# Altium project LED Matrix.PrjPcb
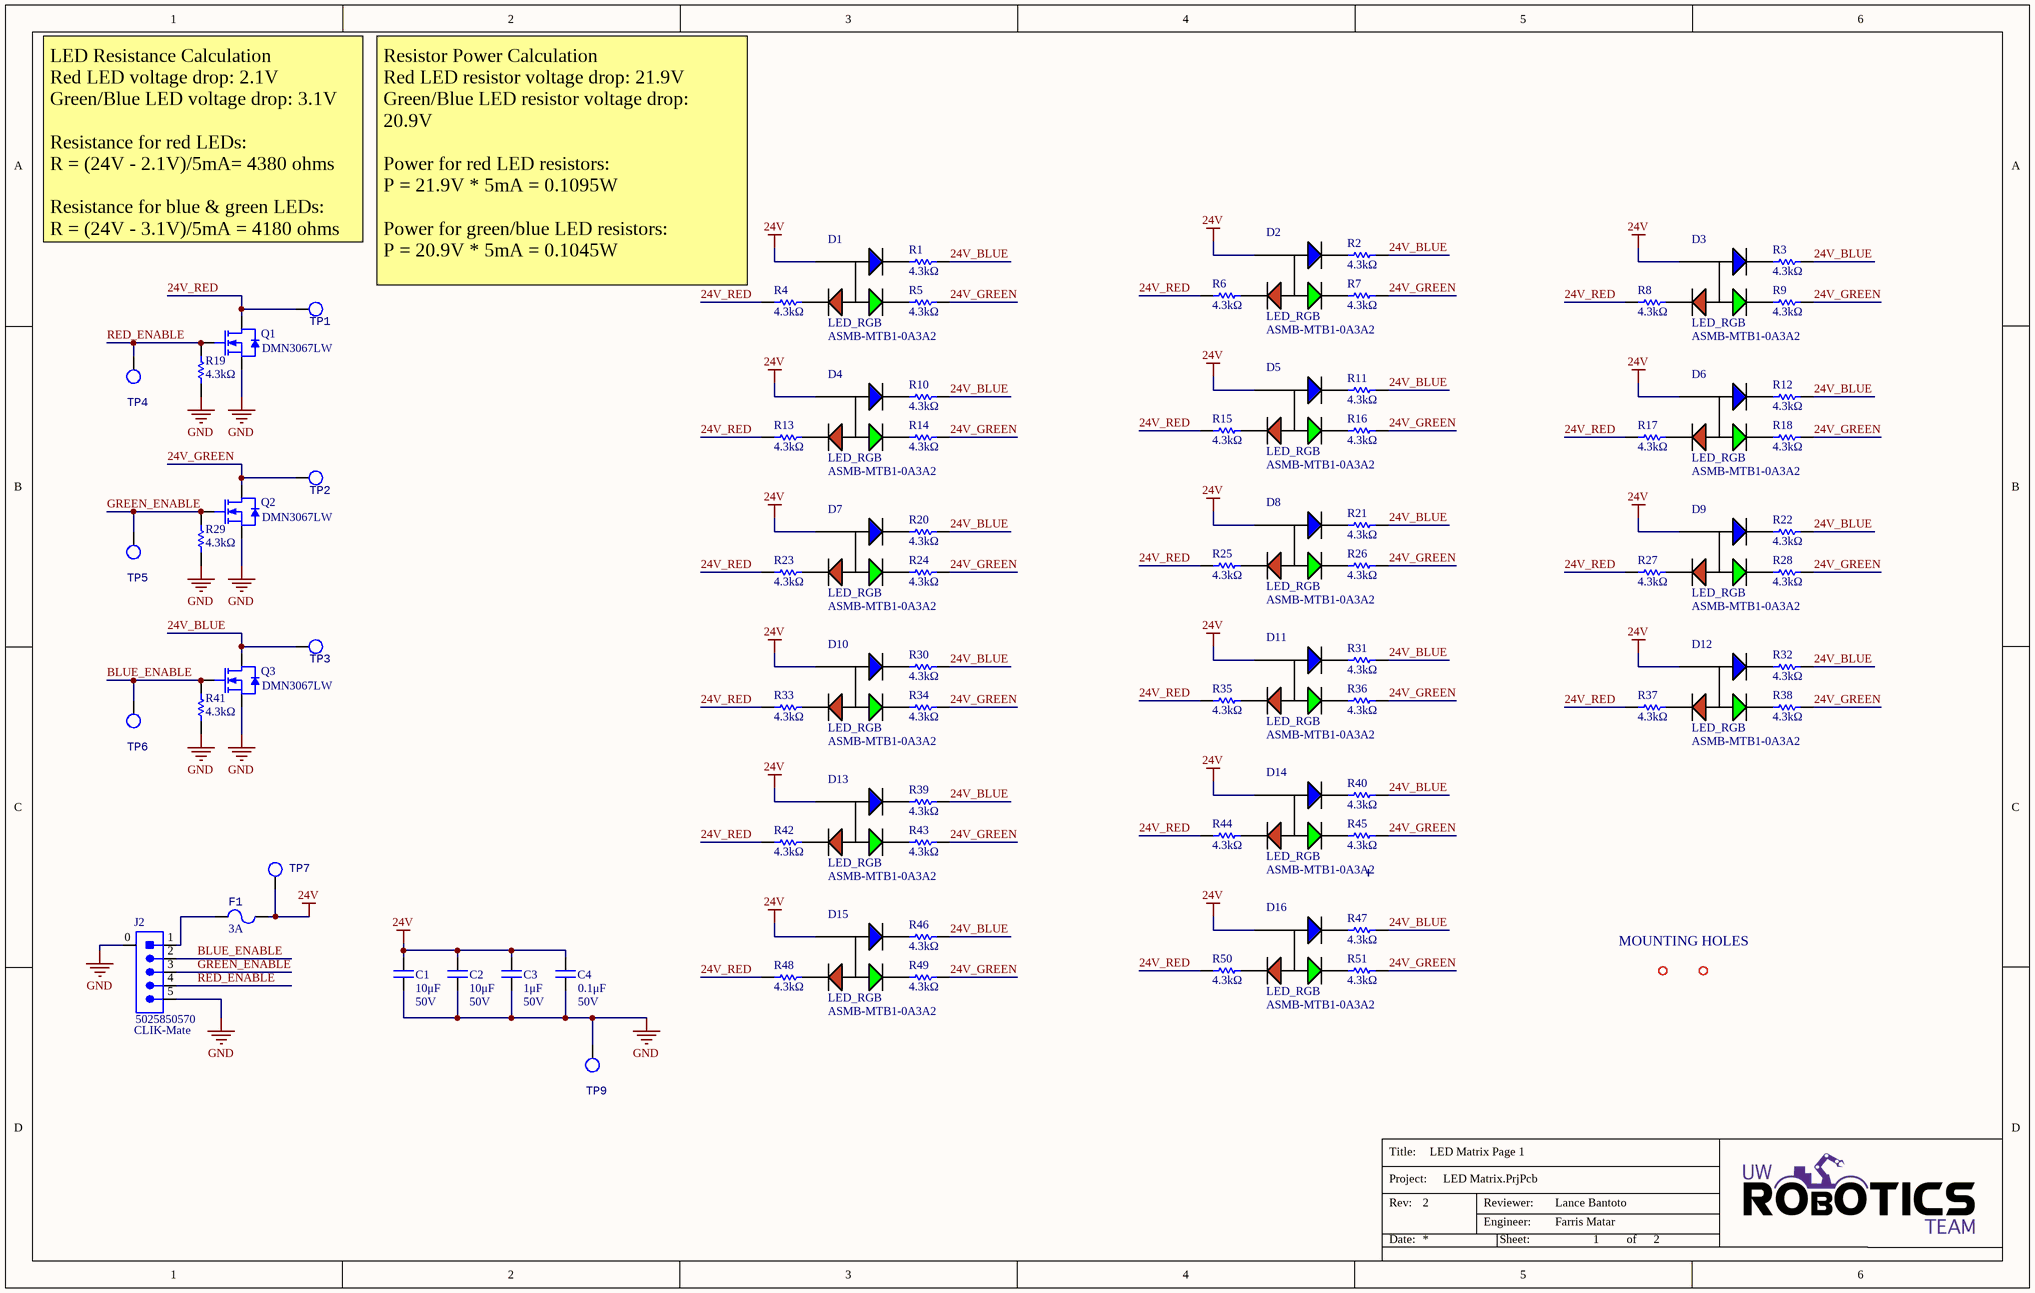
[diagram p0: LED Matrix.SchDoc]
2 sheets, 150 parts. Net scope: global (net labels, ports and power ports of the same name join across sheets).
Board file: LED Matrix.PcbDoc
Sheets:
  LED Matrix.SchDoc
  LED Matrix-2.SchDoc

## Sheet LED Matrix.SchDoc: LED Matrix Page 1
size B; CheckedBy: Lance Bantoto; Engineer: Farris Matar; Revision: 2; SheetNumber: 1; SheetTotal: 2

### Parts
C1  value 10μF  Voltage Rating: 50V  [CAP1210]  (hidden comment: CAP_10uF_50V_1210)
C2  value 10μF  Voltage Rating: 50V  [CAP1210]  (hidden comment: CAP_10uF_50V_1210)
C3  value 1μF  Voltage Rating: 50V  [CAP2012]  (hidden comment: CAP_1uF_50V_0805)
C4  value 0.1μF  Voltage Rating: 50V  [CAP2012]  (hidden comment: CAP_0.1uF_50V_0805)
D1  LED_RGB  Manufacturer Part Number 1: ASMB-MTB1-0A3A2  [LED_RGB]
D2  LED_RGB  Manufacturer Part Number 1: ASMB-MTB1-0A3A2  [LED_RGB]
D3  LED_RGB  Manufacturer Part Number 1: ASMB-MTB1-0A3A2  [LED_RGB]
D4  LED_RGB  Manufacturer Part Number 1: ASMB-MTB1-0A3A2  [LED_RGB]
D5  LED_RGB  Manufacturer Part Number 1: ASMB-MTB1-0A3A2  [LED_RGB]
D6  LED_RGB  Manufacturer Part Number 1: ASMB-MTB1-0A3A2  [LED_RGB]
D7  LED_RGB  Manufacturer Part Number 1: ASMB-MTB1-0A3A2  [LED_RGB]
D8  LED_RGB  Manufacturer Part Number 1: ASMB-MTB1-0A3A2  [LED_RGB]
D9  LED_RGB  Manufacturer Part Number 1: ASMB-MTB1-0A3A2  [LED_RGB]
D10  LED_RGB  Manufacturer Part Number 1: ASMB-MTB1-0A3A2  [LED_RGB]
D11  LED_RGB  Manufacturer Part Number 1: ASMB-MTB1-0A3A2  [LED_RGB]
D12  LED_RGB  Manufacturer Part Number 1: ASMB-MTB1-0A3A2  [LED_RGB]
D13  LED_RGB  Manufacturer Part Number 1: ASMB-MTB1-0A3A2  [LED_RGB]
D14  LED_RGB  Manufacturer Part Number 1: ASMB-MTB1-0A3A2  [LED_RGB]
D15  LED_RGB  Manufacturer Part Number 1: ASMB-MTB1-0A3A2  [LED_RGB]
D16  LED_RGB  Manufacturer Part Number 1: ASMB-MTB1-0A3A2  [LED_RGB]
F1  Current Rating: 3A  [FUSE_1206]  (hidden comment: FUSE_3A_1206)
J2  Manufacturer Part Number 1: 5025850570  Family: CLIK-Mate  [MOLEX-5025850570]  (hidden comment: CON_5M_SM_RA)
MH1  MOUNTING_HOLES  [MOUNTING_HOLE]  (value not drawn)
MH2  MOUNTING_HOLES  [MOUNTING_HOLE]  (value not drawn)
Q1  Manufacturer Part Number 1: DMN3067LW  [NMOS_SOT-323]  (hidden comment: NMOS_30V_2.6A)
Q2  Manufacturer Part Number 1: DMN3067LW  [NMOS_SOT-323]  (hidden comment: NMOS_30V_2.6A)
Q3  Manufacturer Part Number 1: DMN3067LW  [NMOS_SOT-323]  (hidden comment: NMOS_30V_2.6A)
R1  Resistance: 4.3kΩ  [RES1210]  (hidden comment: RES_4.3kΩ_1210_5%)
R2  Resistance: 4.3kΩ  [RES1210]  (hidden comment: RES_4.3kΩ_1210_5%)
R3  Resistance: 4.3kΩ  [RES1210]  (hidden comment: RES_4.3kΩ_1210_5%)
R4  Resistance: 4.3kΩ  [RES1210]  (hidden comment: RES_4.3kΩ_1210_5%)
R5  Resistance: 4.3kΩ  [RES1210]  (hidden comment: RES_4.3kΩ_1210_5%)
R6  Resistance: 4.3kΩ  [RES1210]  (hidden comment: RES_4.3kΩ_1210_5%)
R7  Resistance: 4.3kΩ  [RES1210]  (hidden comment: RES_4.3kΩ_1210_5%)
R8  Resistance: 4.3kΩ  [RES1210]  (hidden comment: RES_4.3kΩ_1210_5%)
R9  Resistance: 4.3kΩ  [RES1210]  (hidden comment: RES_4.3kΩ_1210_5%)
R10  Resistance: 4.3kΩ  [RES1210]  (hidden comment: RES_4.3kΩ_1210_5%)
R11  Resistance: 4.3kΩ  [RES1210]  (hidden comment: RES_4.3kΩ_1210_5%)
R12  Resistance: 4.3kΩ  [RES1210]  (hidden comment: RES_4.3kΩ_1210_5%)
R13  Resistance: 4.3kΩ  [RES1210]  (hidden comment: RES_4.3kΩ_1210_5%)
R14  Resistance: 4.3kΩ  [RES1210]  (hidden comment: RES_4.3kΩ_1210_5%)
R15  Resistance: 4.3kΩ  [RES1210]  (hidden comment: RES_4.3kΩ_1210_5%)
R16  Resistance: 4.3kΩ  [RES1210]  (hidden comment: RES_4.3kΩ_1210_5%)
R17  Resistance: 4.3kΩ  [RES1210]  (hidden comment: RES_4.3kΩ_1210_5%)
R18  Resistance: 4.3kΩ  [RES1210]  (hidden comment: RES_4.3kΩ_1210_5%)
R19  Resistance: 4.3kΩ  [RES1210]  (hidden comment: RES_4.3kΩ_1210_5%)
R20  Resistance: 4.3kΩ  [RES1210]  (hidden comment: RES_4.3kΩ_1210_5%)
R21  Resistance: 4.3kΩ  [RES1210]  (hidden comment: RES_4.3kΩ_1210_5%)
R22  Resistance: 4.3kΩ  [RES1210]  (hidden comment: RES_4.3kΩ_1210_5%)
R23  Resistance: 4.3kΩ  [RES1210]  (hidden comment: RES_4.3kΩ_1210_5%)
R24  Resistance: 4.3kΩ  [RES1210]  (hidden comment: RES_4.3kΩ_1210_5%)
R25  Resistance: 4.3kΩ  [RES1210]  (hidden comment: RES_4.3kΩ_1210_5%)
R26  Resistance: 4.3kΩ  [RES1210]  (hidden comment: RES_4.3kΩ_1210_5%)
R27  Resistance: 4.3kΩ  [RES1210]  (hidden comment: RES_4.3kΩ_1210_5%)
R28  Resistance: 4.3kΩ  [RES1210]  (hidden comment: RES_4.3kΩ_1210_5%)
R29  Resistance: 4.3kΩ  [RES1210]  (hidden comment: RES_4.3kΩ_1210_5%)
R30  Resistance: 4.3kΩ  [RES1210]  (hidden comment: RES_4.3kΩ_1210_5%)
R31  Resistance: 4.3kΩ  [RES1210]  (hidden comment: RES_4.3kΩ_1210_5%)
R32  Resistance: 4.3kΩ  [RES1210]  (hidden comment: RES_4.3kΩ_1210_5%)
R33  Resistance: 4.3kΩ  [RES1210]  (hidden comment: RES_4.3kΩ_1210_5%)
R34  Resistance: 4.3kΩ  [RES1210]  (hidden comment: RES_4.3kΩ_1210_5%)
R35  Resistance: 4.3kΩ  [RES1210]  (hidden comment: RES_4.3kΩ_1210_5%)
R36  Resistance: 4.3kΩ  [RES1210]  (hidden comment: RES_4.3kΩ_1210_5%)
R37  Resistance: 4.3kΩ  [RES1210]  (hidden comment: RES_4.3kΩ_1210_5%)
R38  Resistance: 4.3kΩ  [RES1210]  (hidden comment: RES_4.3kΩ_1210_5%)
R39  Resistance: 4.3kΩ  [RES1210]  (hidden comment: RES_4.3kΩ_1210_5%)
R40  Resistance: 4.3kΩ  [RES1210]  (hidden comment: RES_4.3kΩ_1210_5%)
R41  Resistance: 4.3kΩ  [RES1210]  (hidden comment: RES_4.3kΩ_1210_5%)
R42  Resistance: 4.3kΩ  [RES1210]  (hidden comment: RES_4.3kΩ_1210_5%)
R43  Resistance: 4.3kΩ  [RES1210]  (hidden comment: RES_4.3kΩ_1210_5%)
R44  Resistance: 4.3kΩ  [RES1210]  (hidden comment: RES_4.3kΩ_1210_5%)
R45  Resistance: 4.3kΩ  [RES1210]  (hidden comment: RES_4.3kΩ_1210_5%)
R46  Resistance: 4.3kΩ  [RES1210]  (hidden comment: RES_4.3kΩ_1210_5%)
R47  Resistance: 4.3kΩ  [RES1210]  (hidden comment: RES_4.3kΩ_1210_5%)
R48  Resistance: 4.3kΩ  [RES1210]  (hidden comment: RES_4.3kΩ_1210_5%)
R49  Resistance: 4.3kΩ  [RES1210]  (hidden comment: RES_4.3kΩ_1210_5%)
R50  Resistance: 4.3kΩ  [RES1210]  (hidden comment: RES_4.3kΩ_1210_5%)
R51  Resistance: 4.3kΩ  [RES1210]  (hidden comment: RES_4.3kΩ_1210_5%)
TP1  TESTPOINT_LOOP  [TESTPOINT_LOOP]  (value not drawn)
TP2  TESTPOINT_LOOP  [TESTPOINT_LOOP]  (value not drawn)
TP3  TESTPOINT_LOOP  [TESTPOINT_LOOP]  (value not drawn)
TP4  TESTPOINT_LOOP  [TESTPOINT_LOOP]  (value not drawn)
TP5  TESTPOINT_LOOP  [TESTPOINT_LOOP]  (value not drawn)
TP6  TESTPOINT_LOOP  [TESTPOINT_LOOP]  (value not drawn)
TP7  TESTPOINT_LOOP  [TESTPOINT_LOOP]  (value not drawn)
TP9  TESTPOINT_LOOP  [TESTPOINT_LOOP]  (value not drawn)

### Nets
24V: C1.2 C2.2 C3.1 C4.2 D1.4(COMMON_ANODE) D2.4(COMMON_ANODE) D3.4(COMMON_ANODE) D4.4(COMMON_ANODE) D5.4(COMMON_ANODE) D6.4(COMMON_ANODE) D7.4(COMMON_ANODE) D8.4(COMMON_ANODE) D9.4(COMMON_ANODE) D10.4(COMMON_ANODE) D11.4(COMMON_ANODE) D12.4(COMMON_ANODE) D13.4(COMMON_ANODE) D14.4(COMMON_ANODE) D15.4(COMMON_ANODE) D16.4(COMMON_ANODE) F1.1 TP7.1
GND: C1.1 C2.1 C3.2 C4.1 J2.0 J2.5 Q1.2(SOURCE) Q2.2(SOURCE) Q3.2(SOURCE) R19.1 R29.1 R41.1 TP9.1
24V_BLUE: Q3.3(DRAIN) R1.2 R2.2 R3.2 R10.2 R11.2 R12.2 R20.1 R21.1 R22.1 R30.2 R31.2 R32.2 R39.1 R40.2 R46.2 R47.2 TP3.1
24V_GREEN: Q2.3(DRAIN) R5.2 R7.2 R9.2 R14.2 R16.2 R18.2 R24.2 R26.2 R28.2 R34.2 R36.2 R38.2 R43.2 R45.2 R49.2 R51.2 TP2.1
24V_RED: Q1.3(DRAIN) R4.1 R6.1 R8.1 R13.1 R15.1 R17.1 R23.2 R25.1 R27.1 R33.1 R35.1 R37.1 R42.1 R44.1 R48.1 R50.1 TP1.1
BLUE_ENABLE: J2.2 Q3.1(GATE) R41.2 TP6.1
GREEN_ENABLE: J2.3 Q2.1(GATE) R29.2 TP5.1
RED_ENABLE: J2.4 Q1.1(GATE) R19.2 TP4.1
NetD1_1: D1.1(CATHODE_(RED)) R4.2
NetD1_2: D1.2(CATHODE_(GREEN)) R5.1
NetD1_3: D1.3(CATHODE_(BLUE)) R1.1
NetD2_1: D2.1(CATHODE_(RED)) R6.2
NetD2_2: D2.2(CATHODE_(GREEN)) R7.1
NetD2_3: D2.3(CATHODE_(BLUE)) R2.1
NetD3_1: D3.1(CATHODE_(RED)) R8.2
NetD3_2: D3.2(CATHODE_(GREEN)) R9.1
NetD3_3: D3.3(CATHODE_(BLUE)) R3.1
NetD4_1: D4.1(CATHODE_(RED)) R13.2
NetD4_2: D4.2(CATHODE_(GREEN)) R14.1
NetD4_3: D4.3(CATHODE_(BLUE)) R10.1
NetD5_1: D5.1(CATHODE_(RED)) R15.2
NetD5_2: D5.2(CATHODE_(GREEN)) R16.1
NetD5_3: D5.3(CATHODE_(BLUE)) R11.1
NetD6_1: D6.1(CATHODE_(RED)) R17.2
NetD6_2: D6.2(CATHODE_(GREEN)) R18.1
NetD6_3: D6.3(CATHODE_(BLUE)) R12.1
NetD7_1: D7.1(CATHODE_(RED)) R23.1
NetD7_2: D7.2(CATHODE_(GREEN)) R24.1
NetD7_3: D7.3(CATHODE_(BLUE)) R20.2
NetD8_1: D8.1(CATHODE_(RED)) R25.2
NetD8_2: D8.2(CATHODE_(GREEN)) R26.1
NetD8_3: D8.3(CATHODE_(BLUE)) R21.2
NetD9_1: D9.1(CATHODE_(RED)) R27.2
NetD9_2: D9.2(CATHODE_(GREEN)) R28.1
NetD9_3: D9.3(CATHODE_(BLUE)) R22.2
NetD10_1: D10.1(CATHODE_(RED)) R33.2
NetD10_2: D10.2(CATHODE_(GREEN)) R34.1
NetD10_3: D10.3(CATHODE_(BLUE)) R30.1
NetD11_1: D11.1(CATHODE_(RED)) R35.2
NetD11_2: D11.2(CATHODE_(GREEN)) R36.1
NetD11_3: D11.3(CATHODE_(BLUE)) R31.1
NetD12_1: D12.1(CATHODE_(RED)) R37.2
NetD12_2: D12.2(CATHODE_(GREEN)) R38.1
NetD12_3: D12.3(CATHODE_(BLUE)) R32.1
NetD13_1: D13.1(CATHODE_(RED)) R42.2
NetD13_2: D13.2(CATHODE_(GREEN)) R43.1
NetD13_3: D13.3(CATHODE_(BLUE)) R39.2
NetD14_1: D14.1(CATHODE_(RED)) R44.2
NetD14_2: D14.2(CATHODE_(GREEN)) R45.1
NetD14_3: D14.3(CATHODE_(BLUE)) R40.1
NetD15_1: D15.1(CATHODE_(RED)) R48.2
NetD15_2: D15.2(CATHODE_(GREEN)) R49.1
NetD15_3: D15.3(CATHODE_(BLUE)) R46.1
NetD16_1: D16.1(CATHODE_(RED)) R50.2
NetD16_2: D16.2(CATHODE_(GREEN)) R51.1
NetD16_3: D16.3(CATHODE_(BLUE)) R47.1
NetF1_2: F1.2 J2.1

### Notes on the sheet
- LED Resistance Calculation
  Red LED voltage drop: 2.1V
  Green/Blue LED voltage drop: 3.1V
  Resistance for red LEDs:
  R = (24V - 2.1V)/5mA= 4380 ohms
  Resistance for blue & green LEDs:
  R = (24V - 3.1V)/5mA = 4180 ohms
- (near R4) Resistor Power Calculation
  Red LED resistor voltage drop: 21.9V
  Green/Blue LED resistor voltage drop: 20.9V
  Power for red LED resistors:
  P = 21.9V * 5mA = 0.1095W
  Power for green/blue LED resistors:
  P = 20.9V * 5mA = 0.1045W
  All resistors used in this schematic are 1210
- MOUNTING HOLES
- Title:
- Project:
- Date:
- Rev:
- Reviewer:
- Engineer:
- Sheet:
- of

### Library data of the parts
C1 C2 = CAP_10uF_50V_1210: CAP CER 10UF 50V X7R 1210; Manufacturer 1: Murata Electronics; Manufacturer Part Number 1: GRM32ER71H106MA12L; Supplier 1: Digi-Key; Supplier Part Number 1: 490-12775-1-ND; Dielectric: X7R
C3 = CAP_1uF_50V_0805: CAP CER 1UF 50V X7R 0805; Manufacturer Part Number 1: CL21B105KBFNNNG; Manufacturer 1: Samsung Electro-Mechanics; Package/Footprint: 0805; Supplier 1: Digi-Key; Supplier Part Number 1: 1276-6470-1-ND; Mounting Type: SMD; LCSC Part #: C28323
C4 = CAP_0.1uF_50V_0805: CAP CER 0.1UF 50V X7R 0805; Manufacturer 1: Murata Electronics; Manufacturer Part Number 1: GCM21BR71H104KA37K; Package/Footprint: 0805; Supplier 1: Digi-Key; Dielectric: X7R; Supplier Part Number 1: 490-8049-1-ND; Mounting Type: SMD; LCSC Part #: C49678
D1-D16 = LED_RGB: LED RGB DIFFUSED 4PLCC SMD; Manufacturer 1: Broadcom; Color: Blue,Green,Red; Lens Color: White; Viewing Angle: 115°; Lens Style: Round; Luminous Intensity: 350mcd; Dominant Wavelength: 470nm; Forward Voltage: 3.1V; Test Current: 20mA; Package/Footprint: 4-PLCC; Supplier 1: Digi-Key; Number of Pins: 4; Lens Transparency: Diffused; Supplier Part Number 1: 516-3280-1-ND; Mounting Type: SMD
F1 = FUSE_3A_1206: FUSE BOARD MNT 3A 32VAC/VDC 1206; Manufacturer 1: Littelfuse; Manufacturer Part Number 1: 0466003.NR; Package/Footprint: 1206; Supplier 1: Digi-Key; Supplier Part Number 1: F1458CT-ND; Mounting Type: SMD
J2 = CON_5M_SM_RA: CONN HEADER SMD RIGHT ANGLE 1.5MM PITCH; Manufacturer 1: Molex; Current Rating: 2A; Supplier Part Number 1: WM14469CT-ND; Supplier 1: Digi-Key; Mounting Type: SMD; Package/Footprint: SMD; Orientation: Right Angle
MH1 MH2 = MOUNTING_HOLES: 6cm x 6cm
Q1-Q3 = NMOS_30V_2.6A: MOSFET N-CH 30V 2.6A SOT-323; Manufacturer 1: Diodes Incorporated; Vgs (Max): ±12V; Supplier 1: Digi-Key; Supplier Part Number 1: DMN3067LW-7DICT-ND; Mounting Type: SMD; Package/Footprint: SOT-323; Vdss: 30V; Id: 2.6A
R1-R51 = RES_4.3kΩ_1210_5%: RES 4.3K OHM 5% 1/2W 1210; Manufacturer 1: Panasonic; Manufacturer Part Number 1: ERJ-14YJ432U; Supplier 1: Digi-Key; Tolerance: 5%; Supplier Part Number 1: P4.3KVCT-ND; Package: 1210; Mounting Type: SMD
TP1-TP7 TP9 = TESTPOINT_LOOP: TESTPOINT THRUHOLE; Manufacturer 1: Keystone Electronics; Manufacturer Part Number 1: 5002; Package/Footprint: TH; Supplier Part Number 1: 36-5002-ND; Supplier 1: Digi-Key; Mounting Type: TH

## Sheet LED Matrix-2.SchDoc: LED Matrix Page 2
size B; CheckedBy: Lance Bantoto; Engineer: Farris Matar; Revision: 2; SheetNumber: 2; SheetTotal: 2
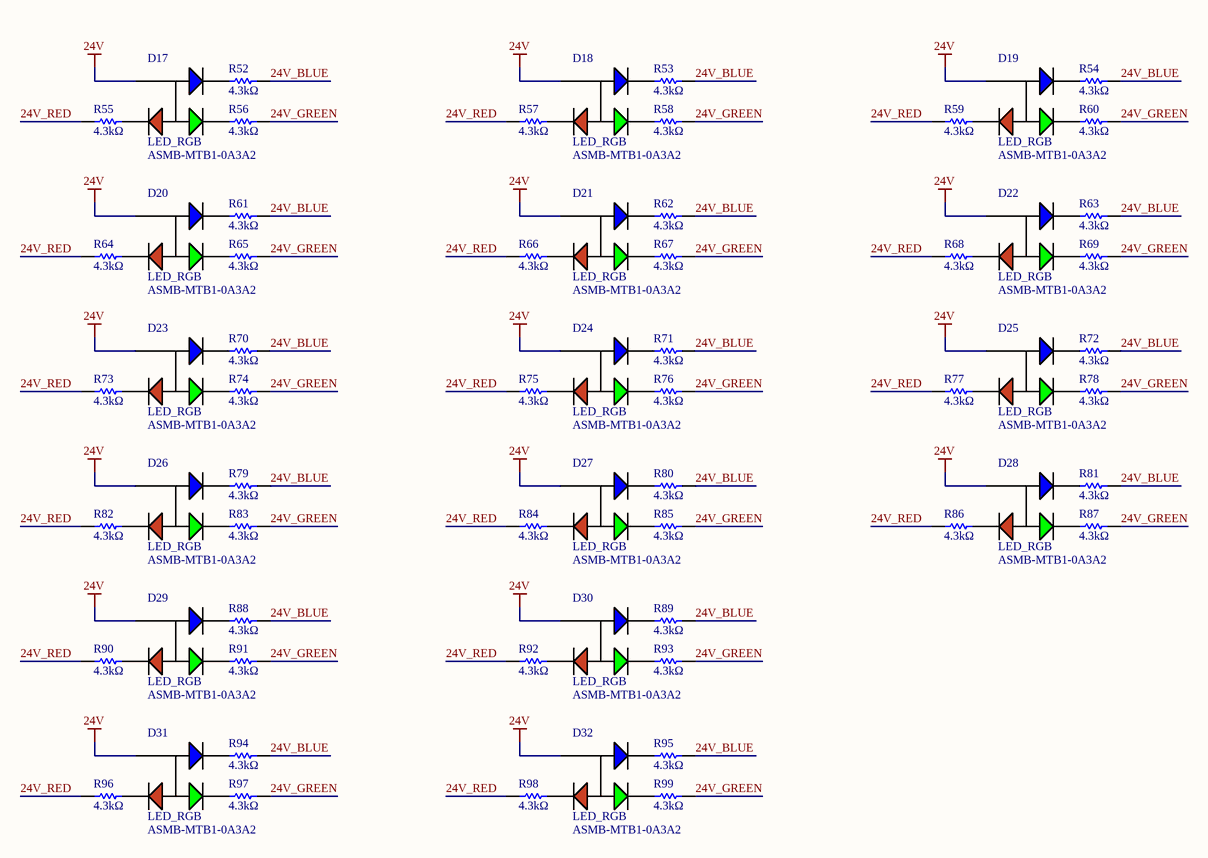
[diagram p1: LED Matrix-2.SchDoc]

### Parts
D17  LED_RGB  Manufacturer Part Number 1: ASMB-MTB1-0A3A2  [LED_RGB]
D18  LED_RGB  Manufacturer Part Number 1: ASMB-MTB1-0A3A2  [LED_RGB]
D19  LED_RGB  Manufacturer Part Number 1: ASMB-MTB1-0A3A2  [LED_RGB]
D20  LED_RGB  Manufacturer Part Number 1: ASMB-MTB1-0A3A2  [LED_RGB]
D21  LED_RGB  Manufacturer Part Number 1: ASMB-MTB1-0A3A2  [LED_RGB]
D22  LED_RGB  Manufacturer Part Number 1: ASMB-MTB1-0A3A2  [LED_RGB]
D23  LED_RGB  Manufacturer Part Number 1: ASMB-MTB1-0A3A2  [LED_RGB]
D24  LED_RGB  Manufacturer Part Number 1: ASMB-MTB1-0A3A2  [LED_RGB]
D25  LED_RGB  Manufacturer Part Number 1: ASMB-MTB1-0A3A2  [LED_RGB]
D26  LED_RGB  Manufacturer Part Number 1: ASMB-MTB1-0A3A2  [LED_RGB]
D27  LED_RGB  Manufacturer Part Number 1: ASMB-MTB1-0A3A2  [LED_RGB]
D28  LED_RGB  Manufacturer Part Number 1: ASMB-MTB1-0A3A2  [LED_RGB]
D29  LED_RGB  Manufacturer Part Number 1: ASMB-MTB1-0A3A2  [LED_RGB]
D30  LED_RGB  Manufacturer Part Number 1: ASMB-MTB1-0A3A2  [LED_RGB]
D31  LED_RGB  Manufacturer Part Number 1: ASMB-MTB1-0A3A2  [LED_RGB]
D32  LED_RGB  Manufacturer Part Number 1: ASMB-MTB1-0A3A2  [LED_RGB]
R52  Resistance: 4.3kΩ  [RES1210]  (hidden comment: RES_4.3kΩ_1210_5%)
R53  Resistance: 4.3kΩ  [RES1210]  (hidden comment: RES_4.3kΩ_1210_5%)
R54  Resistance: 4.3kΩ  [RES1210]  (hidden comment: RES_4.3kΩ_1210_5%)
R55  Resistance: 4.3kΩ  [RES1210]  (hidden comment: RES_4.3kΩ_1210_5%)
R56  Resistance: 4.3kΩ  [RES1210]  (hidden comment: RES_4.3kΩ_1210_5%)
R57  Resistance: 4.3kΩ  [RES1210]  (hidden comment: RES_4.3kΩ_1210_5%)
R58  Resistance: 4.3kΩ  [RES1210]  (hidden comment: RES_4.3kΩ_1210_5%)
R59  Resistance: 4.3kΩ  [RES1210]  (hidden comment: RES_4.3kΩ_1210_5%)
R60  Resistance: 4.3kΩ  [RES1210]  (hidden comment: RES_4.3kΩ_1210_5%)
R61  Resistance: 4.3kΩ  [RES1210]  (hidden comment: RES_4.3kΩ_1210_5%)
R62  Resistance: 4.3kΩ  [RES1210]  (hidden comment: RES_4.3kΩ_1210_5%)
R63  Resistance: 4.3kΩ  [RES1210]  (hidden comment: RES_4.3kΩ_1210_5%)
R64  Resistance: 4.3kΩ  [RES1210]  (hidden comment: RES_4.3kΩ_1210_5%)
R65  Resistance: 4.3kΩ  [RES1210]  (hidden comment: RES_4.3kΩ_1210_5%)
R66  Resistance: 4.3kΩ  [RES1210]  (hidden comment: RES_4.3kΩ_1210_5%)
R67  Resistance: 4.3kΩ  [RES1210]  (hidden comment: RES_4.3kΩ_1210_5%)
R68  Resistance: 4.3kΩ  [RES1210]  (hidden comment: RES_4.3kΩ_1210_5%)
R69  Resistance: 4.3kΩ  [RES1210]  (hidden comment: RES_4.3kΩ_1210_5%)
R70  Resistance: 4.3kΩ  [RES1210]  (hidden comment: RES_4.3kΩ_1210_5%)
R71  Resistance: 4.3kΩ  [RES1210]  (hidden comment: RES_4.3kΩ_1210_5%)
R72  Resistance: 4.3kΩ  [RES1210]  (hidden comment: RES_4.3kΩ_1210_5%)
R73  Resistance: 4.3kΩ  [RES1210]  (hidden comment: RES_4.3kΩ_1210_5%)
R74  Resistance: 4.3kΩ  [RES1210]  (hidden comment: RES_4.3kΩ_1210_5%)
R75  Resistance: 4.3kΩ  [RES1210]  (hidden comment: RES_4.3kΩ_1210_5%)
R76  Resistance: 4.3kΩ  [RES1210]  (hidden comment: RES_4.3kΩ_1210_5%)
R77  Resistance: 4.3kΩ  [RES1210]  (hidden comment: RES_4.3kΩ_1210_5%)
R78  Resistance: 4.3kΩ  [RES1210]  (hidden comment: RES_4.3kΩ_1210_5%)
R79  Resistance: 4.3kΩ  [RES1210]  (hidden comment: RES_4.3kΩ_1210_5%)
R80  Resistance: 4.3kΩ  [RES1210]  (hidden comment: RES_4.3kΩ_1210_5%)
R81  Resistance: 4.3kΩ  [RES1210]  (hidden comment: RES_4.3kΩ_1210_5%)
R82  Resistance: 4.3kΩ  [RES1210]  (hidden comment: RES_4.3kΩ_1210_5%)
R83  Resistance: 4.3kΩ  [RES1210]  (hidden comment: RES_4.3kΩ_1210_5%)
R84  Resistance: 4.3kΩ  [RES1210]  (hidden comment: RES_4.3kΩ_1210_5%)
R85  Resistance: 4.3kΩ  [RES1210]  (hidden comment: RES_4.3kΩ_1210_5%)
R86  Resistance: 4.3kΩ  [RES1210]  (hidden comment: RES_4.3kΩ_1210_5%)
R87  Resistance: 4.3kΩ  [RES1210]  (hidden comment: RES_4.3kΩ_1210_5%)
R88  Resistance: 4.3kΩ  [RES1210]  (hidden comment: RES_4.3kΩ_1210_5%)
R89  Resistance: 4.3kΩ  [RES1210]  (hidden comment: RES_4.3kΩ_1210_5%)
R90  Resistance: 4.3kΩ  [RES1210]  (hidden comment: RES_4.3kΩ_1210_5%)
R91  Resistance: 4.3kΩ  [RES1210]  (hidden comment: RES_4.3kΩ_1210_5%)
R92  Resistance: 4.3kΩ  [RES1210]  (hidden comment: RES_4.3kΩ_1210_5%)
R93  Resistance: 4.3kΩ  [RES1210]  (hidden comment: RES_4.3kΩ_1210_5%)
R94  Resistance: 4.3kΩ  [RES1210]  (hidden comment: RES_4.3kΩ_1210_5%)
R95  Resistance: 4.3kΩ  [RES1210]  (hidden comment: RES_4.3kΩ_1210_5%)
R96  Resistance: 4.3kΩ  [RES1210]  (hidden comment: RES_4.3kΩ_1210_5%)
R97  Resistance: 4.3kΩ  [RES1210]  (hidden comment: RES_4.3kΩ_1210_5%)
R98  Resistance: 4.3kΩ  [RES1210]  (hidden comment: RES_4.3kΩ_1210_5%)
R99  Resistance: 4.3kΩ  [RES1210]  (hidden comment: RES_4.3kΩ_1210_5%)

### Nets
24V: D17.4(COMMON_ANODE) D18.4(COMMON_ANODE) D19.4(COMMON_ANODE) D20.4(COMMON_ANODE) D21.4(COMMON_ANODE) D22.4(COMMON_ANODE) D23.4(COMMON_ANODE) D24.4(COMMON_ANODE) D25.4(COMMON_ANODE) D26.4(COMMON_ANODE) D27.4(COMMON_ANODE) D28.4(COMMON_ANODE) D29.4(COMMON_ANODE) D30.4(COMMON_ANODE) D31.4(COMMON_ANODE) D32.4(COMMON_ANODE)
24V_BLUE: R52.2 R53.2 R54.2 R61.2 R62.2 R63.2 R70.2 R71.2 R72.2 R79.2 R80.2 R81.2 R88.2 R89.2 R94.2 R95.2
24V_GREEN: R56.2 R58.2 R60.2 R65.2 R67.2 R69.2 R74.2 R76.2 R78.2 R83.2 R85.2 R87.2 R91.2 R93.2 R97.2 R99.2
24V_RED: R55.1 R57.1 R59.1 R64.1 R66.1 R68.1 R73.1 R75.1 R77.1 R82.1 R84.1 R86.1 R90.1 R92.1 R96.1 R98.1
NetD17_1: D17.1(CATHODE_(RED)) R55.2
NetD17_2: D17.2(CATHODE_(GREEN)) R56.1
NetD17_3: D17.3(CATHODE_(BLUE)) R52.1
NetD18_1: D18.1(CATHODE_(RED)) R57.2
NetD18_2: D18.2(CATHODE_(GREEN)) R58.1
NetD18_3: D18.3(CATHODE_(BLUE)) R53.1
NetD19_1: D19.1(CATHODE_(RED)) R59.2
NetD19_2: D19.2(CATHODE_(GREEN)) R60.1
NetD19_3: D19.3(CATHODE_(BLUE)) R54.1
NetD20_1: D20.1(CATHODE_(RED)) R64.2
NetD20_2: D20.2(CATHODE_(GREEN)) R65.1
NetD20_3: D20.3(CATHODE_(BLUE)) R61.1
NetD21_1: D21.1(CATHODE_(RED)) R66.2
NetD21_2: D21.2(CATHODE_(GREEN)) R67.1
NetD21_3: D21.3(CATHODE_(BLUE)) R62.1
NetD22_1: D22.1(CATHODE_(RED)) R68.2
NetD22_2: D22.2(CATHODE_(GREEN)) R69.1
NetD22_3: D22.3(CATHODE_(BLUE)) R63.1
NetD23_1: D23.1(CATHODE_(RED)) R73.2
NetD23_2: D23.2(CATHODE_(GREEN)) R74.1
NetD23_3: D23.3(CATHODE_(BLUE)) R70.1
NetD24_1: D24.1(CATHODE_(RED)) R75.2
NetD24_2: D24.2(CATHODE_(GREEN)) R76.1
NetD24_3: D24.3(CATHODE_(BLUE)) R71.1
NetD25_1: D25.1(CATHODE_(RED)) R77.2
NetD25_2: D25.2(CATHODE_(GREEN)) R78.1
NetD25_3: D25.3(CATHODE_(BLUE)) R72.1
NetD26_1: D26.1(CATHODE_(RED)) R82.2
NetD26_2: D26.2(CATHODE_(GREEN)) R83.1
NetD26_3: D26.3(CATHODE_(BLUE)) R79.1
NetD27_1: D27.1(CATHODE_(RED)) R84.2
NetD27_2: D27.2(CATHODE_(GREEN)) R85.1
NetD27_3: D27.3(CATHODE_(BLUE)) R80.1
NetD28_1: D28.1(CATHODE_(RED)) R86.2
NetD28_2: D28.2(CATHODE_(GREEN)) R87.1
NetD28_3: D28.3(CATHODE_(BLUE)) R81.1
NetD29_1: D29.1(CATHODE_(RED)) R90.2
NetD29_2: D29.2(CATHODE_(GREEN)) R91.1
NetD29_3: D29.3(CATHODE_(BLUE)) R88.1
NetD30_1: D30.1(CATHODE_(RED)) R92.2
NetD30_2: D30.2(CATHODE_(GREEN)) R93.1
NetD30_3: D30.3(CATHODE_(BLUE)) R89.1
NetD31_1: D31.1(CATHODE_(RED)) R96.2
NetD31_2: D31.2(CATHODE_(GREEN)) R97.1
NetD31_3: D31.3(CATHODE_(BLUE)) R94.1
NetD32_1: D32.1(CATHODE_(RED)) R98.2
NetD32_2: D32.2(CATHODE_(GREEN)) R99.1
NetD32_3: D32.3(CATHODE_(BLUE)) R95.1

### Notes on the sheet
- Title:
- Project:
- Date:
- Rev:
- Reviewer:
- Engineer:
- Sheet:
- of

### Library data of the parts
D17-D32 = LED_RGB: as D1 on sheet LED Matrix; Supplier 1: Digi-Key; Number of Pins: 4; Lens Transparency: Diffused; Supplier Part Number 1: 516-3280-1-ND; Mounting Type: SMD
R52-R99 = RES_4.3kΩ_1210_5%: as R1 on sheet LED Matrix; Supplier 1: Digi-Key; Tolerance: 5%; Supplier Part Number 1: P4.3KVCT-ND; Package: 1210; Mounting Type: SMD

## Nets that join several sheets
24V: LED Matrix (22 pins), LED Matrix-2 (16 pins)
24V_BLUE: LED Matrix (18 pins), LED Matrix-2 (16 pins)
24V_GREEN: LED Matrix (18 pins), LED Matrix-2 (16 pins)
24V_RED: LED Matrix (18 pins), LED Matrix-2 (16 pins)